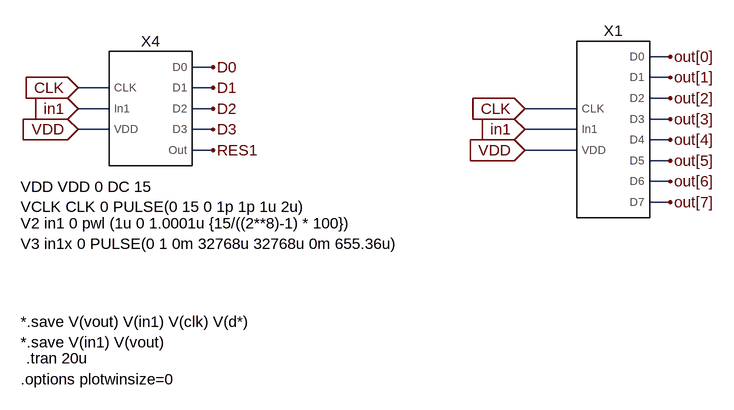
[diagram p0: schematic 4Bit_ADC_DAC_pipeV2.asc]
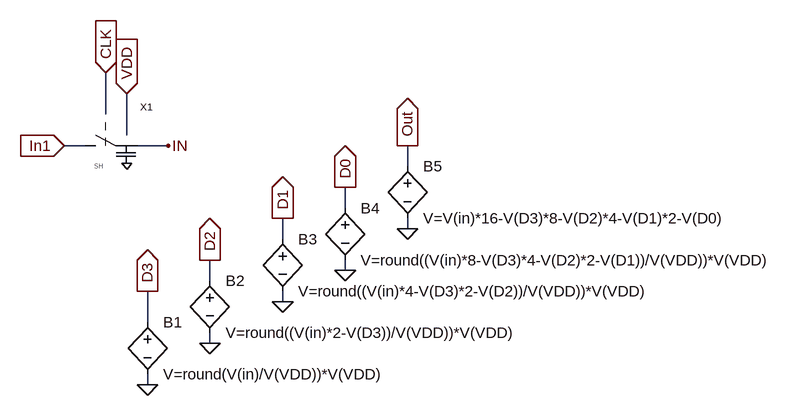
[diagram p1: sub-circuit 4bit_adc_pipe.asc]
4Bit_ADC_DAC_pipeV2.asc, the LTspice schematic file:
Version 4
SHEET 1 1096 1532
WIRE 992 112 960 112
WIRE 288 128 256 128
WIRE 992 144 960 144
WIRE 128 160 80 160
WIRE 288 160 256 160
WIRE 992 176 960 176
WIRE 128 192 80 192
WIRE 288 192 256 192
WIRE 848 192 768 192
WIRE 992 208 960 208
WIRE 128 224 80 224
WIRE 288 224 256 224
WIRE 848 224 768 224
WIRE 992 240 960 240
WIRE 288 256 256 256
WIRE 848 256 768 256
WIRE 992 272 960 272
WIRE 992 304 960 304
WIRE 992 336 960 336
FLAG 80 160 CLK
IOPIN 80 160 In
FLAG 80 224 VDD
IOPIN 80 224 In
FLAG 80 192 in1
IOPIN 80 192 In
FLAG 288 256 RES1
FLAG 288 224 D3
FLAG 288 192 D2
FLAG 288 160 D1
FLAG 288 128 D0
FLAG 768 192 CLK
IOPIN 768 192 In
FLAG 768 256 VDD
IOPIN 768 256 In
FLAG 768 224 in1
IOPIN 768 224 In
FLAG 992 112 out[0]
FLAG 992 144 out[1]
FLAG 992 176 out[2]
FLAG 992 208 out[3]
FLAG 992 240 out[4]
FLAG 992 272 out[5]
FLAG 992 304 out[6]
FLAG 992 336 out[7]
SYMBOL 4Bit_ADC_pipe 192 192 R0
SYMATTR InstName X4
SYMBOL 4Bit_ADC_pipeV2 896 224 R0
SYMATTR InstName X1
TEXT -8 312 Left 2 !VDD VDD 0 DC 15\nVCLK CLK 0 PULSE(0 15 0 1p 1p 1u 2u)
TEXT 0 576 Left 2 !.tran 20u
TEXT -8 608 Left 2 !.options plotwinsize=0
TEXT -8 520 Left 2 !*.save V(vout) V(in1) V(clk) V(d*)\n*.save V(in1) V(vout)
TEXT -8 368 Left 2 !V2 in1 0 pwl (1u 0 1.0001u {15/((2**8)-1) * 100})
TEXT -8 400 Left 2 !V3 in1x 0 PULSE(0 1 0m 32768u 32768u 0m 655.36u)

4bit_adc_pipe.asc, the sub-circuit schematic file:
Version 4
SHEET 1 1812 680
WIRE 48 -272 48 -336
WIRE 80 -240 80 -304
WIRE 16 -224 -16 -224
WIRE 144 -224 96 -224
WIRE 512 -192 512 -224
WIRE 416 -128 416 -160
WIRE 512 -96 512 -112
WIRE 320 -80 320 -112
WIRE 416 -32 416 -48
WIRE 208 -16 208 -48
WIRE 320 16 320 0
WIRE 112 48 112 0
WIRE 208 80 208 64
WIRE 112 144 112 128
FLAG 144 -224 IN
FLAG 112 144 0
FLAG 112 0 D3
IOPIN 112 0 Out
FLAG 208 80 0
FLAG 208 -48 D2
IOPIN 208 -48 Out
FLAG 320 16 0
FLAG 320 -112 D1
IOPIN 320 -112 Out
FLAG 416 -32 0
FLAG 416 -160 D0
IOPIN 416 -160 Out
FLAG 512 -96 0
FLAG 512 -224 Out
IOPIN 512 -224 Out
FLAG -16 -224 In1
IOPIN -16 -224 In
FLAG 48 -336 CLK
IOPIN 48 -336 In
FLAG 80 -304 VDD
IOPIN 80 -304 In
SYMBOL bv 112 32 R0
SYMATTR InstName B1
SYMATTR Value V=round(V(in)/V(VDD))*V(VDD)
SYMBOL bv 208 -32 R0
SYMATTR InstName B2
SYMATTR Value V=round((V(in)*2-V(D3))/V(VDD))*V(VDD)
SYMBOL bv 320 -96 R0
SYMATTR InstName B3
SYMATTR Value V=round((V(in)*4-V(D3)*2-V(D2))/V(VDD))*V(VDD)
SYMBOL bv 416 -144 R0
SYMATTR InstName B4
SYMATTR Value V=round((V(in)*8-V(D3)*4-V(D2)*2-V(D1))/V(VDD))*V(VDD)
SYMBOL bv 512 -208 R0
SYMATTR InstName B5
SYMATTR Value V=V(in)*16-V(D3)*8-V(D2)*4-V(D1)*2-V(D0)
SYMBOL sample_hold 16 -208 R0
SYMATTR InstName X1

The netlist it stands for:
* 4Bit_ADC_DAC_pipeV2.asc
XX4 CLK in1 VDD D0 D1 D2 D3 RES1 4bit_adc_pipe
XX1 CLK in1 VDD out[0] out[1] out[2] out[3] out[4] out[5] out[6] out[7] 4Bit_ADC_pipeV2  ; pins CLK In1 VDD D0 D1 D2 D3 D4 D5 D6 D7

* block symbol definitions
.subckt 4bit_adc_pipe CLK In1 VDD D0 D1 D2 D3 Out
B1 D3 0 V=round(V(in)/V(VDD))*V(VDD)
B2 D2 0 V=round((V(in)*2-V(D3))/V(VDD))*V(VDD)
B3 D1 0 V=round((V(in)*4-V(D3)*2-V(D2))/V(VDD))*V(VDD)
B4 D0 0 V=round((V(in)*8-V(D3)*4-V(D2)*2-V(D1))/V(VDD))*V(VDD)
B5 Out 0 V=V(in)*16-V(D3)*8-V(D2)*4-V(D1)*2-V(D0)
XX1 In1 IN CLK VDD sample_hold  ; pins P1 P2 clk VDD
.ends 4bit_adc_pipe

VDD VDD 0 DC 15
VCLK CLK 0 PULSE(0 15 0 1p 1p 1u 2u)
.tran 20u
.options plotwinsize=0
*.save V(vout) V(in1) V(clk) V(d*)
*.save V(in1) V(vout)
V2 in1 0 pwl (1u 0 1.0001u {15/((2**8)-1) * 100})
V3 in1x 0 PULSE(0 1 0m 32768u 32768u 0m 655.36u)
.backanno
.end